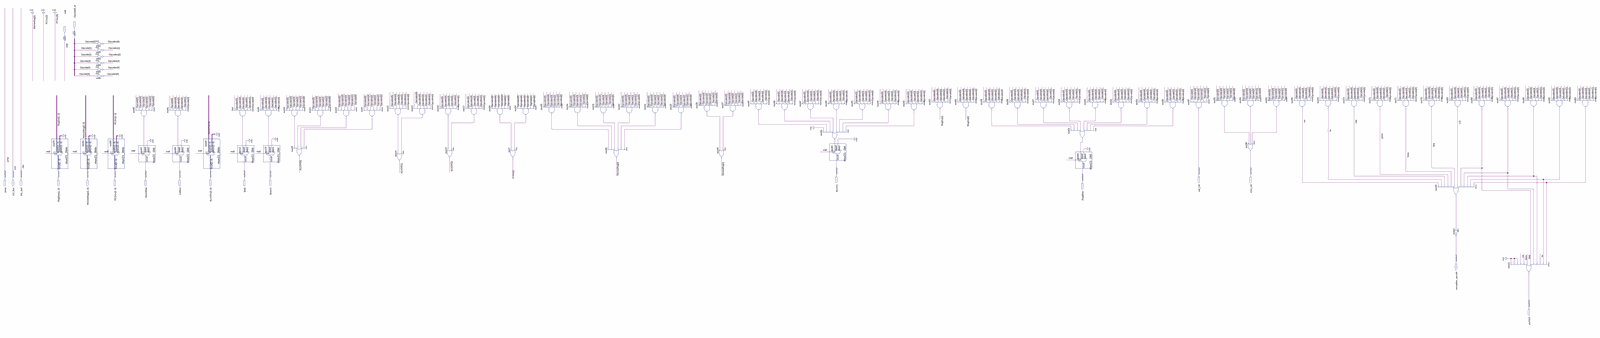
[diagram p0: schematic sheet, whole]
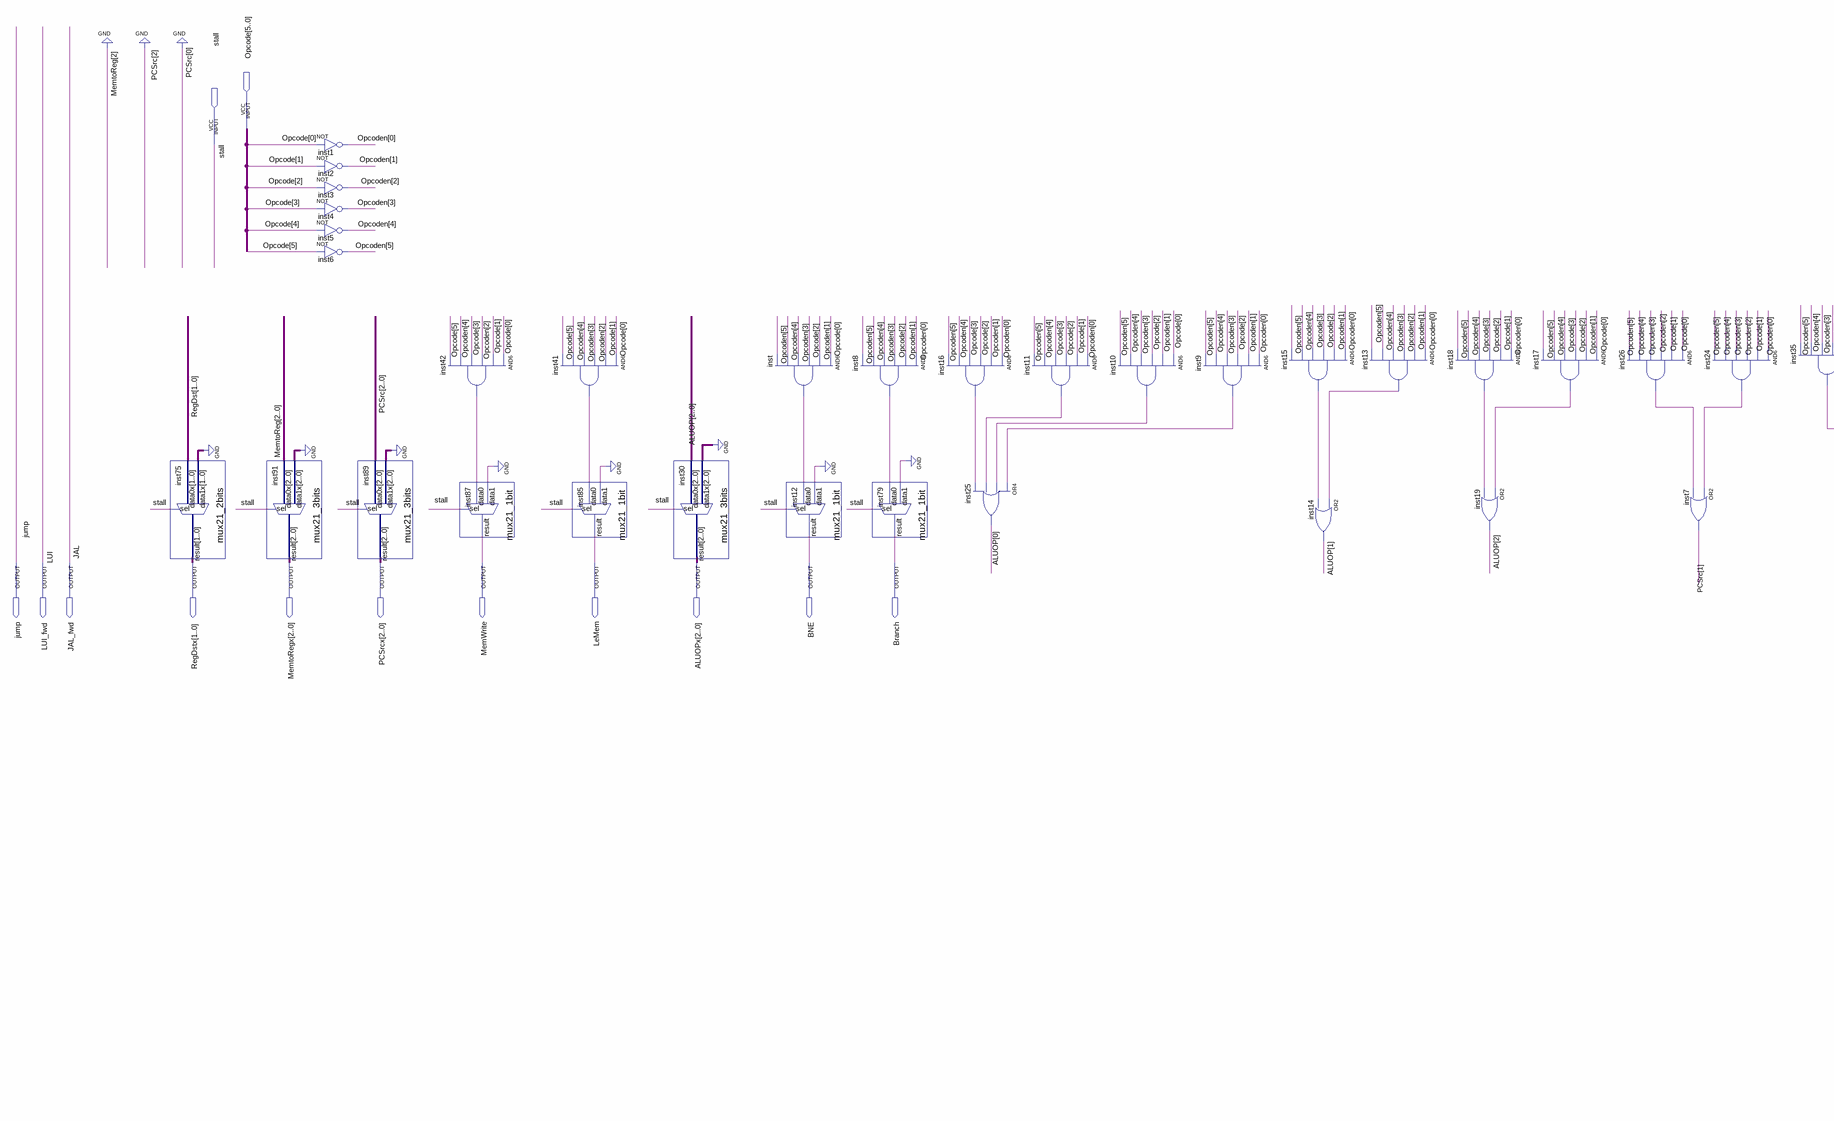
[diagram p1: schematic sheet, left part]
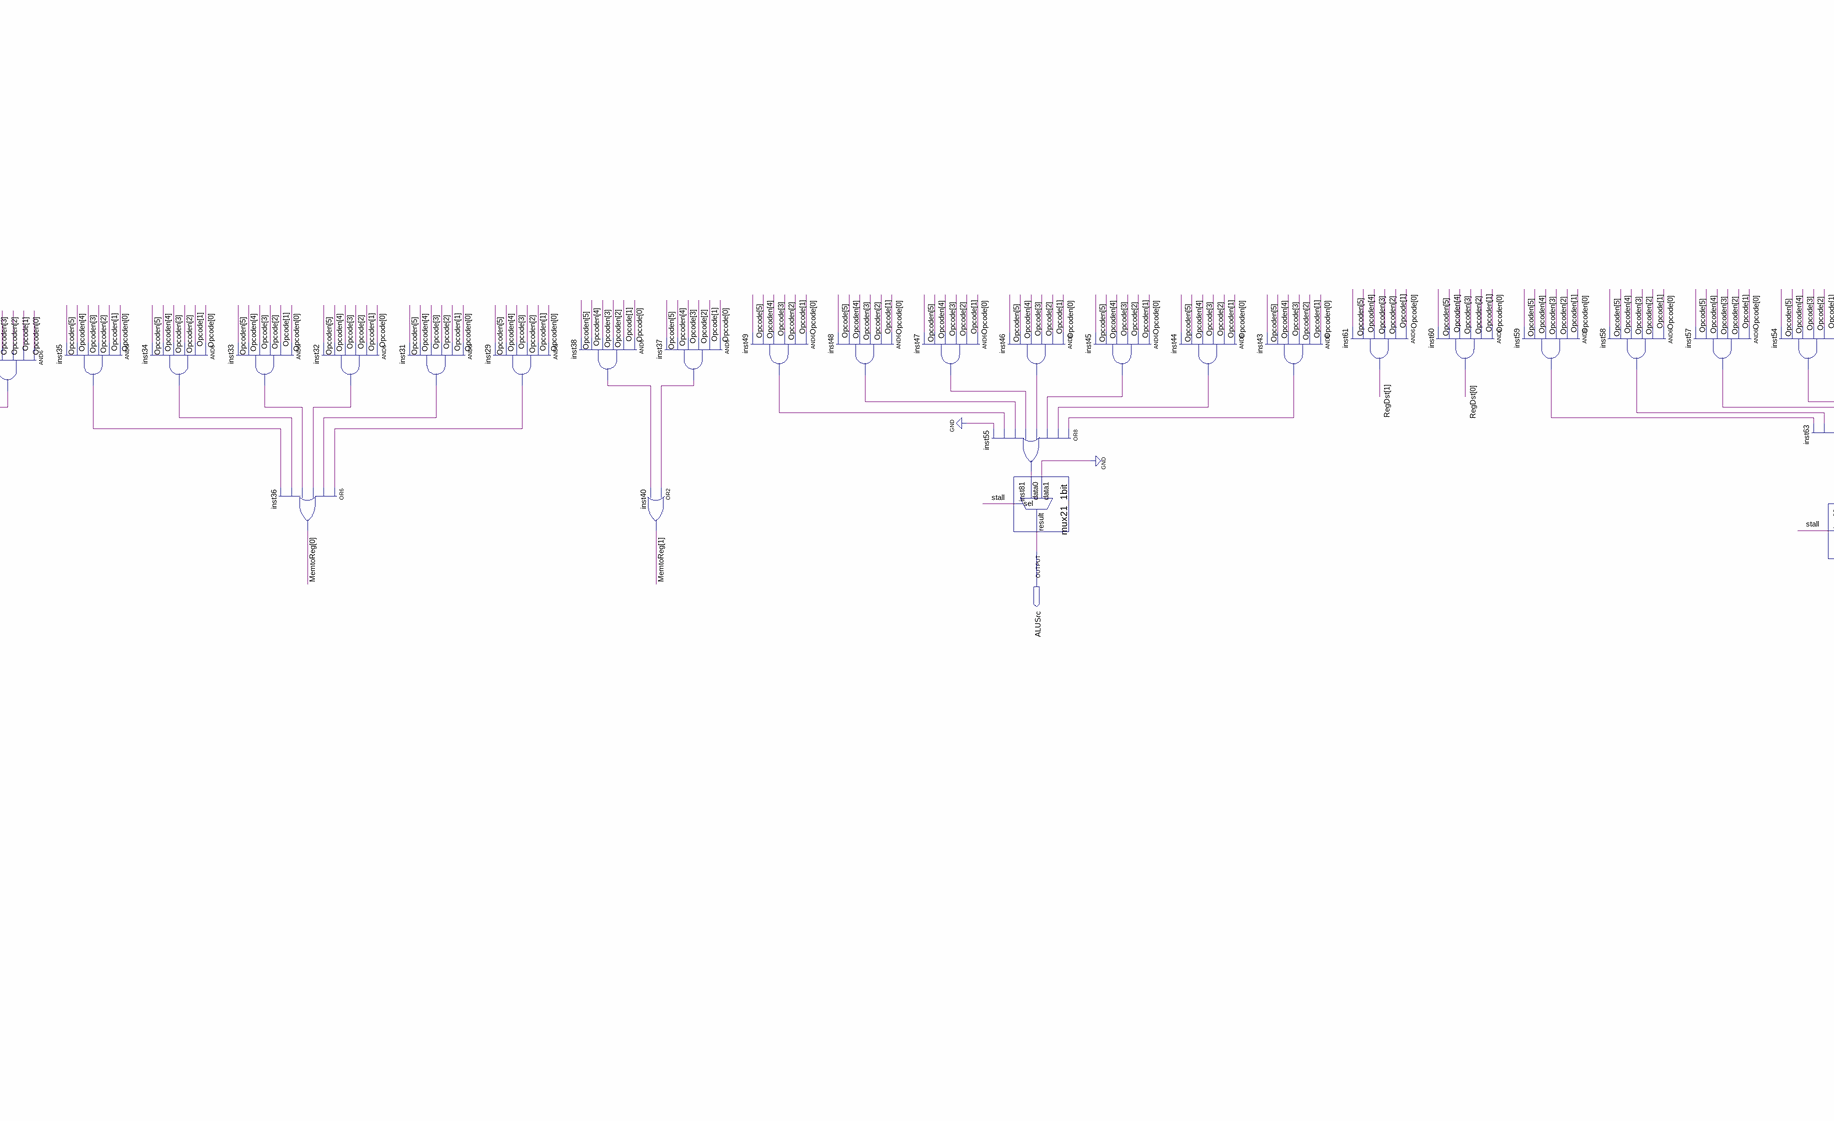
[diagram p2: schematic sheet, centre part]
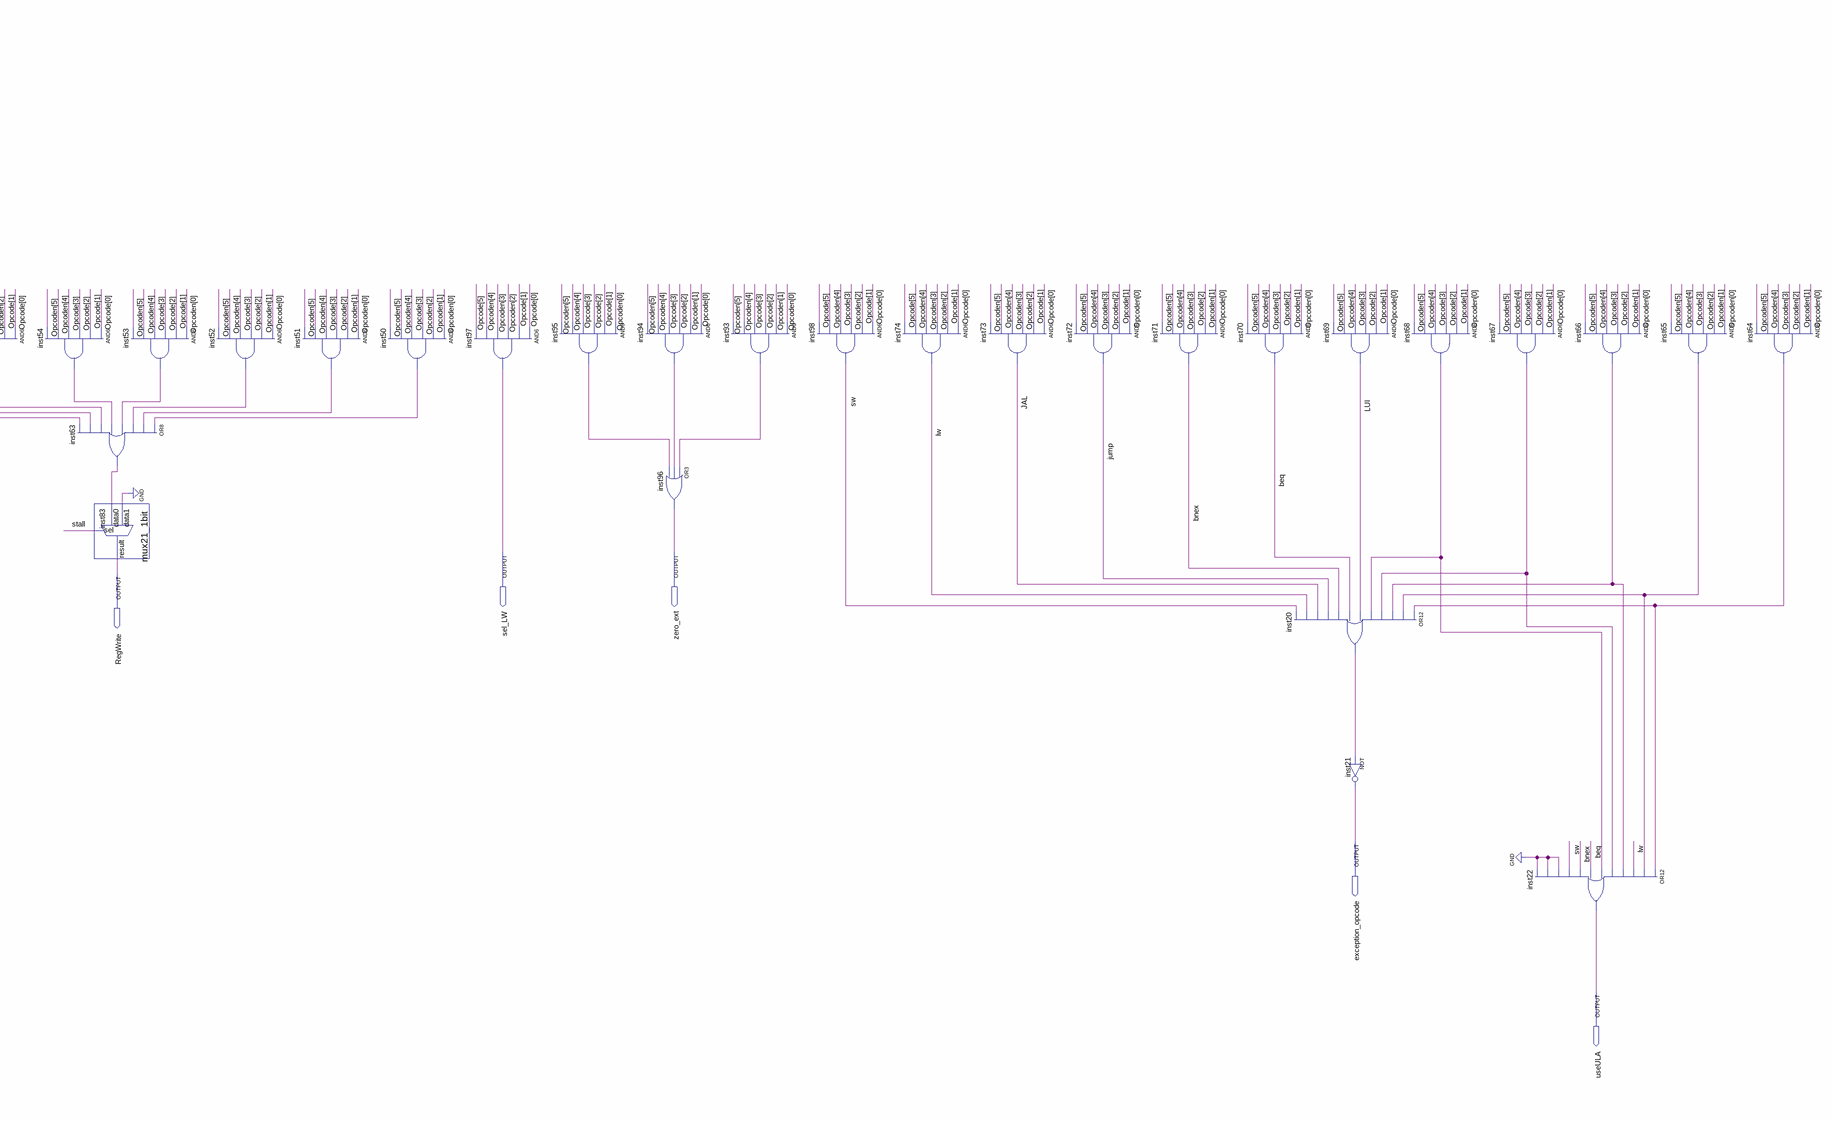
[diagram p3: schematic sheet, right part]
// Quartus schematic controlepipe.bdf as structural Verilog: 83 symbols, 19 pins
module controlepipe (
  input  [5:0] Opcode,
  input  stall,
  output ALUSrc,
  output sel_LW,
  output zero_ext,
  output jump,
  output LUI_fwd,
  output JAL_fwd,
  output [1:0] RegDstx,
  output [2:0] MemtoRegx,
  output [2:0] PCSrcx,
  output MemWrite,
  output LeMem,
  output [2:0] ALUOPx,
  output BNE,
  output Branch,
  output RegWrite,
  output exception_opcode,
  output useULA
);

  wire beq, bnex, inst8_out, inst9_out, inst10_out, inst11_out, inst13_out, inst15_out, inst16_out,
       inst17_out, inst18_out, inst20_out, inst24_out, inst26_out, inst29_out, inst31_out, inst32_out,
       inst33_out, inst34_out, inst35_out, inst37_out, inst38_out, inst41_out, inst42_out, inst43_out,
       inst44_out, inst45_out, inst46_out, inst47_out, inst48_out, inst49_out, inst50_out, inst51_out,
       inst52_out, inst53_out, inst54_out, inst55_out, inst57_out, inst58_out, inst59_out, inst63_out,
       inst64_out, inst65_out, inst66_out, inst67_out, inst68_out, inst93_out, inst94_out, inst95_out,
       inst_out, lw, sw;
  wire [1:0] MemtoReg, RegDst;
  wire [1:1] PCSrc;
  wire [2:0] ALUOP;
  wire [5:0] Opcoden;

  mux21_2bits inst75 (.data1x(2'b00), .data0x(RegDst), .sel(stall), .result(RegDstx));
  mux21_3bits inst91 (.data1x(3'b000), .data0x({1'b0, MemtoReg}), .sel(stall), .result(MemtoRegx));
  not inst1 (Opcoden[0], Opcode[0]);
  not inst2 (Opcoden[1], Opcode[1]);
  not inst3 (Opcoden[2], Opcode[2]);
  not inst4 (Opcoden[3], Opcode[3]);
  not inst5 (Opcoden[4], Opcode[4]);
  not inst6 (Opcoden[5], Opcode[5]);
  mux21_3bits inst89 (.data1x(3'b000), .data0x({1'b0, PCSrc[1], 1'b0}), .sel(stall), .result(PCSrcx));
  and inst42 (inst42_out, Opcode[0], Opcode[1], Opcoden[2], Opcode[3], Opcoden[4], Opcode[5]);
  mux21_1bit inst87 (.data1(1'b0), .data0(inst42_out), .sel(stall), .result(MemWrite));
  and inst41 (inst41_out, Opcode[0], Opcode[1], Opcoden[2], Opcoden[3], Opcoden[4], Opcode[5]);
  mux21_1bit inst85 (.data1(1'b0), .data0(inst41_out), .sel(stall), .result(LeMem));
  mux21_3bits inst30 (.data1x(3'b000), .data0x(ALUOP), .sel(stall), .result(ALUOPx));
  and inst (inst_out, Opcode[0], Opcoden[1], Opcode[2], Opcoden[3], Opcoden[4], Opcoden[5]);
  mux21_1bit inst12 (.data1(1'b0), .data0(inst_out), .sel(stall), .result(BNE));
  and inst8 (inst8_out, Opcoden[0], Opcoden[1], Opcode[2], Opcoden[3], Opcoden[4], Opcoden[5]);
  mux21_1bit inst79 (.data1(1'b0), .data0(inst8_out), .sel(stall), .result(Branch));
  and inst16 (inst16_out, Opcoden[0], Opcoden[1], Opcode[2], Opcode[3], Opcoden[4], Opcoden[5]);
  or inst25 (ALUOP[0], inst9_out, inst10_out, inst11_out, inst16_out);
  and inst11 (inst11_out, Opcoden[0], Opcode[1], Opcode[2], Opcode[3], Opcoden[4], Opcoden[5]);
  and inst10 (inst10_out, Opcode[0], Opcoden[1], Opcode[2], Opcoden[3], Opcoden[4], Opcoden[5]);
  and inst9 (inst9_out, Opcoden[0], Opcoden[1], Opcode[2], Opcoden[3], Opcoden[4], Opcoden[5]);
  and inst15 (inst15_out, Opcoden[0], Opcoden[1], Opcode[2], Opcode[3], Opcoden[4], Opcoden[5]);
  or inst14 (ALUOP[1], inst13_out, inst15_out);
  and inst13 (inst13_out, Opcoden[0], Opcoden[1], Opcoden[2], Opcoden[3], Opcoden[4], Opcoden[5]);
  and inst18 (inst18_out, Opcoden[0], Opcode[1], Opcode[2], Opcode[3], Opcoden[4], Opcoden[5]);
  or inst19 (ALUOP[2], inst17_out, inst18_out);
  and inst17 (inst17_out, Opcode[0], Opcoden[1], Opcode[2], Opcode[3], Opcoden[4], Opcoden[5]);
  and inst26 (inst26_out, Opcode[0], Opcode[1], Opcoden[2], Opcoden[3], Opcoden[4], Opcoden[5]);
  and inst24 (inst24_out, Opcoden[0], Opcode[1], Opcoden[2], Opcoden[3], Opcoden[4], Opcoden[5]);
  or inst7 (PCSrc[1], inst24_out, inst26_out);
  and inst35 (inst35_out, Opcoden[0], Opcoden[1], Opcoden[2], Opcoden[3], Opcoden[4], Opcoden[5]);
  and inst34 (inst34_out, Opcode[0], Opcode[1], Opcoden[2], Opcoden[3], Opcoden[4], Opcoden[5]);
  and inst33 (inst33_out, Opcoden[0], Opcode[1], Opcode[2], Opcode[3], Opcoden[4], Opcoden[5]);
  or inst36 (MemtoReg[0], inst29_out, inst31_out, inst32_out, inst33_out, inst34_out, inst35_out);
  and inst32 (inst32_out, Opcode[0], Opcoden[1], Opcode[2], Opcode[3], Opcoden[4], Opcoden[5]);
  and inst31 (inst31_out, Opcoden[0], Opcoden[1], Opcode[2], Opcode[3], Opcoden[4], Opcoden[5]);
  and inst29 (inst29_out, Opcoden[0], Opcoden[1], Opcoden[2], Opcode[3], Opcoden[4], Opcoden[5]);
  and inst38 (inst38_out, Opcode[0], Opcode[1], Opcoden[2], Opcoden[3], Opcoden[4], Opcoden[5]);
  and inst37 (inst37_out, Opcode[0], Opcode[1], Opcode[2], Opcode[3], Opcoden[4], Opcoden[5]);
  or inst40 (MemtoReg[1], inst37_out, inst38_out);
  and inst49 (inst49_out, Opcode[0], Opcode[1], Opcoden[2], Opcode[3], Opcoden[4], Opcode[5]);
  and inst48 (inst48_out, Opcode[0], Opcode[1], Opcoden[2], Opcoden[3], Opcoden[4], Opcode[5]);
  and inst47 (inst47_out, Opcode[0], Opcode[1], Opcode[2], Opcode[3], Opcoden[4], Opcoden[5]);
  and inst46 (inst46_out, Opcoden[0], Opcode[1], Opcode[2], Opcode[3], Opcoden[4], Opcoden[5]);
  or inst55 (inst55_out, inst43_out, inst44_out, inst45_out, inst46_out, inst47_out, inst48_out, inst49_out, 1'b0);
  mux21_1bit inst81 (.data1(1'b0), .data0(inst55_out), .sel(stall), .result(ALUSrc));
  and inst45 (inst45_out, Opcode[0], Opcoden[1], Opcode[2], Opcode[3], Opcoden[4], Opcoden[5]);
  and inst44 (inst44_out, Opcoden[0], Opcoden[1], Opcode[2], Opcode[3], Opcoden[4], Opcoden[5]);
  and inst43 (inst43_out, Opcoden[0], Opcoden[1], Opcoden[2], Opcode[3], Opcoden[4], Opcoden[5]);
  and inst61 (RegDst[1], Opcode[0], Opcode[1], Opcoden[2], Opcoden[3], Opcoden[4], Opcoden[5]);
  and inst60 (RegDst[0], Opcoden[0], Opcoden[1], Opcoden[2], Opcoden[3], Opcoden[4], Opcoden[5]);
  and inst59 (inst59_out, Opcoden[0], Opcoden[1], Opcoden[2], Opcoden[3], Opcoden[4], Opcoden[5]);
  and inst58 (inst58_out, Opcode[0], Opcode[1], Opcoden[2], Opcoden[3], Opcoden[4], Opcoden[5]);
  and inst57 (inst57_out, Opcode[0], Opcode[1], Opcoden[2], Opcoden[3], Opcoden[4], Opcode[5]);
  and inst54 (inst54_out, Opcode[0], Opcode[1], Opcode[2], Opcode[3], Opcoden[4], Opcoden[5]);
  or inst63 (inst63_out, inst50_out, inst51_out, inst52_out, inst53_out, inst54_out, inst57_out, inst58_out, inst59_out);
  and inst53 (inst53_out, Opcoden[0], Opcode[1], Opcode[2], Opcode[3], Opcoden[4], Opcoden[5]);
  mux21_1bit inst83 (.data1(1'b0), .data0(inst63_out), .sel(stall), .result(RegWrite));
  and inst52 (inst52_out, Opcode[0], Opcoden[1], Opcode[2], Opcode[3], Opcoden[4], Opcoden[5]);
  and inst51 (inst51_out, Opcoden[0], Opcoden[1], Opcode[2], Opcode[3], Opcoden[4], Opcoden[5]);
  and inst50 (inst50_out, Opcoden[0], Opcoden[1], Opcoden[2], Opcode[3], Opcoden[4], Opcoden[5]);
  and inst97 (sel_LW, Opcode[0], Opcode[1], Opcoden[2], Opcoden[3], Opcoden[4], Opcode[5]);
  and inst95 (inst95_out, Opcoden[0], Opcode[1], Opcode[2], Opcode[3], Opcoden[4], Opcoden[5]);
  and inst94 (inst94_out, Opcode[0], Opcoden[1], Opcode[2], Opcode[3], Opcoden[4], Opcoden[5]);
  or inst96 (zero_ext, inst93_out, inst94_out, inst95_out);
  and inst93 (inst93_out, Opcoden[0], Opcoden[1], Opcode[2], Opcode[3], Opcoden[4], Opcoden[5]);
  and inst98 (sw, Opcode[0], Opcode[1], Opcoden[2], Opcode[3], Opcoden[4], Opcode[5]);
  and inst74 (lw, Opcode[0], Opcode[1], Opcoden[2], Opcoden[3], Opcoden[4], Opcode[5]);
  and inst73 (JAL_fwd, Opcode[0], Opcode[1], Opcoden[2], Opcoden[3], Opcoden[4], Opcoden[5]);
  and inst72 (jump, Opcoden[0], Opcode[1], Opcoden[2], Opcoden[3], Opcoden[4], Opcoden[5]);
  and inst71 (bnex, Opcode[0], Opcoden[1], Opcode[2], Opcoden[3], Opcoden[4], Opcoden[5]);
  and inst70 (beq, Opcoden[0], Opcoden[1], Opcode[2], Opcoden[3], Opcoden[4], Opcoden[5]);
  or inst20 (inst20_out, inst64_out, inst65_out, inst66_out, inst67_out, inst68_out, LUI_fwd, beq, bnex, jump, JAL_fwd, lw, sw);
  and inst69 (LUI_fwd, Opcode[0], Opcode[1], Opcode[2], Opcode[3], Opcoden[4], Opcoden[5]);
  not inst21 (exception_opcode, inst20_out);
  and inst68 (inst68_out, Opcoden[0], Opcode[1], Opcode[2], Opcode[3], Opcoden[4], Opcoden[5]);
  and inst67 (inst67_out, Opcode[0], Opcoden[1], Opcode[2], Opcode[3], Opcoden[4], Opcoden[5]);
  or inst22 (useULA, inst64_out, inst65_out, lw, inst66_out, inst67_out, inst68_out, beq, bnex, sw, 1'b0, 1'b0, 1'b0);
  and inst66 (inst66_out, Opcoden[0], Opcoden[1], Opcode[2], Opcode[3], Opcoden[4], Opcoden[5]);
  and inst65 (inst65_out, Opcoden[0], Opcoden[1], Opcoden[2], Opcode[3], Opcoden[4], Opcoden[5]);
  and inst64 (inst64_out, Opcoden[0], Opcoden[1], Opcoden[2], Opcoden[3], Opcoden[4], Opcoden[5]);

  // Other names for the same wires on the sheet: JAL = JAL_fwd; LUI = LUI_fwd
endmodule
